# EasyEDA Pro project filter.eprj

# Schematic Schematic-LowPass
Board Name: Filter-LowPass; Create Date: 2025-11-16; Page Name: LowPass; Project Name: filter; Schematic Name: Schematic-LowPass; Update Date: 2025-11-16; Company: EasyEDA.com; Page Size: A4; Version: V1.0
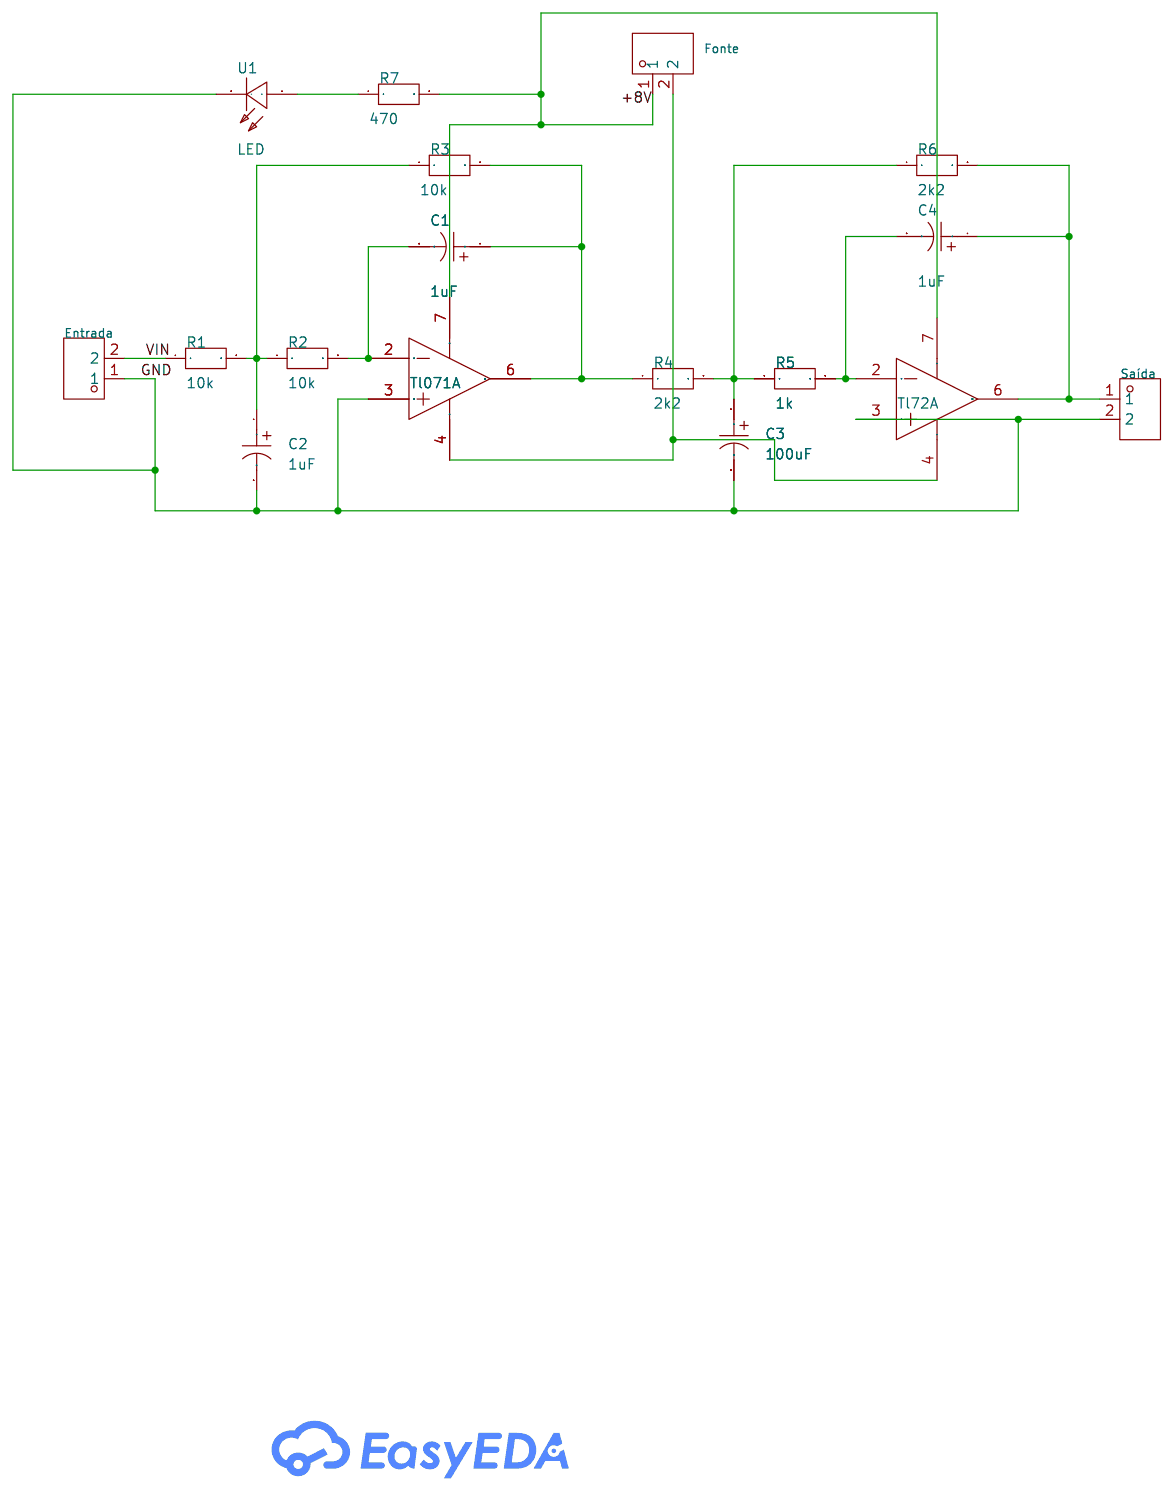
[diagram p0: schematic sheet]

## Parts
C1  1uF  [CAP-TH_BD5.0-P2.00-D0.5-FD-1]
C2  1uF  [CAP-TH_BD5.0-P2.00-D0.5-FD-1]
C3  100uF  [CAP-TH_BD5.0-P2.00-D0.5-FD-1]
C4  1uF  [CAP-TH_BD5.0-P2.00-D0.5-FD-1]
Entrada  KF128L-5.08-2P  [CONN-TH_P5.08_KF128L-5.08-2P]
Fonte  KF128L-5.08-2P  [CONN-TH_P5.08_KF128L-5.08-2P]
R1  10k  [RES-TH_BD2.3-L6.5-P10.50-D0.5]
R2  10k  [RES-TH_BD2.3-L6.5-P10.50-D0.5]
R3  10k  [RES-TH_BD2.3-L6.5-P10.50-D0.5]
R4  2k2  [RES-TH_BD2.3-L6.5-P10.50-D0.5]
R5  1k  [RES-TH_BD2.3-L6.5-P10.50-D0.5]
R6  2k2  [RES-TH_BD2.3-L6.5-P10.50-D0.5]
R7  470  [RES-TH_BD2.3-L6.5-P10.50-D0.5]
Saída  KF128L-5.08-2P  [CONN-TH_P5.08_KF128L-5.08-2P]
Tl071  CA3140N-TD  [DIP-8_L9.3-W6.4-P2.54-LS7.6-BL-1]  (section 1)
Tl72  CA3140N-TD  [DIP-8_L9.3-W6.4-P2.54-LS7.6-BL-1]  (section 1)
U1  LED  [LED-TH_BD4.0-P2.54-FD_RED]

## Library data of the parts
C1-C4 = 50V1uF CD110: LCSC Part Name: 1uF ±20% 50V; Supplier Part: C2960204; Manufacturer: HRK(鸿瑞凯电子); Supplier Footprint: 插件,D5xL11mm; JLCPCB Part Class: Extended Part; Datasheet: https://item.szlcsc.com/datasheet/50V1uF%2520CD110/3346916.html; Supplier: LCSC; Tolerance: ±20%; Voltage Rating: 50V; Pin Spacing: 2mm; Diameter: 5mm; Height - Seated (Max): 11mm; Operating Temperature: -40℃~+105℃
Entrada Fonte Saída = KF128L-5.08-2P: Structure:1x2P Pitch:5.08mm Color:Green Mounting Style:Straight Current Rating (Max):24A Voltage Rating (Max):250V Number of Pins:2P Number of Rows:1 Wire Gauge - AWG:12~22 Wire Gauge - AWG:12~22 Wire Gauge - mm2:2.5 Wire Gauge - mm2:2.5 Number of PINs Pe; LCSC Part Name: 5.08mm 1x2P 排数:1 每排P数:2 直插; Supplier Part: C474940; Manufacturer: KEFA(科发); Supplier Footprint: 插件,P=5.08mm; JLCPCB Part Class: Extended Part; Datasheet: https://atta.szlcsc.com/upload/public/pdf/source/20230317/B060EDB51EF5BF4A4FF6377D02780B11.pdf; Supplier: LCSC; Structure: 1x2P; Pitch: 5.08mm; Color: Green; Mounting Style: Straight; Current Rating (Max): 24A; Voltage Rating (Max): 250V; Number of Pins: 2P; Number of Rows: 1; Wire Gauge - AWG: 12~22; Wire Gauge - mm2: 2.5; Number of PINs Per Row: 2; Operating Temperature Range: -40℃~+105℃
R1-R7 = MF1/4W-1KΩ±1%T52: Type:Metal Film Resistors Resistance: Tolerance:±1% Tolerance:±1% Power(Watts):250mW Temperature Coefficient:±200ppm/℃ Temperature Coefficient:±200ppm/℃; LCSC Part Name: 金属膜电阻 1kΩ ±1% 250mW; Supplier Part: C713997; Manufacturer: 华星机电; Supplier Footprint: 插件,D2.3xL6.5mm; JLCPCB Part Class: Extended Part; Datasheet: https://atta.szlcsc.com/upload/public/pdf/source/20200731/C713882_AE8EB1102749D7E4FB4FB13DC898C429.pdf; Supplier: LCSC; Type: Metal Film Resistors; Tolerance: ±1%; Power(Watts): 250mW; Temperature Coefficient: ±200ppm/℃
Tl071 Tl72 = CA3140N-TD: Supplier Part: C52741396; Manufacturer: TDSEMIC(拓电半导体); Supplier Footprint: DIP-8; JLCPCB Part Class: Extended Part; Datasheet: https://item.szlcsc.com/datasheet/CA3140N-TD/55630013.html; Supplier: LCSC
U1 = LED: Supplier Part: C9900015665; Supplier Footprint: SIP-2P; JLCPCB Part Class: Extended Part; Supplier: LCSC

## Nets
+8V: Fonte.1 R7.2 Tl071.7(V+) Tl72.7(V+)
GND: C2.2 C3.2 Entrada.1 Saída.2 Tl071.3(IN+) Tl72.3(IN+) U1.2(-)
VIN: Entrada.2 R1.1
$1N827: C2.1 R1.2 R2.1 R3.1
$1N888: C1.1 R3.2 R4.1 Tl071.6(OUT)
$1N1062: C3.1 R4.2 R5.1 R6.1
$1N1233: C4.2 R5.2 Tl72.2(IN-)
$1N1279: C4.1 R6.2 Saída.1 Tl72.6(OUT)
$1N1381: Fonte.2 Tl071.4(V-) Tl72.4(V-)
$1N1539: R7.1 U1.1(+)
$1N2048: C1.2 R2.2 Tl071.2(IN-)

# Board LowPass
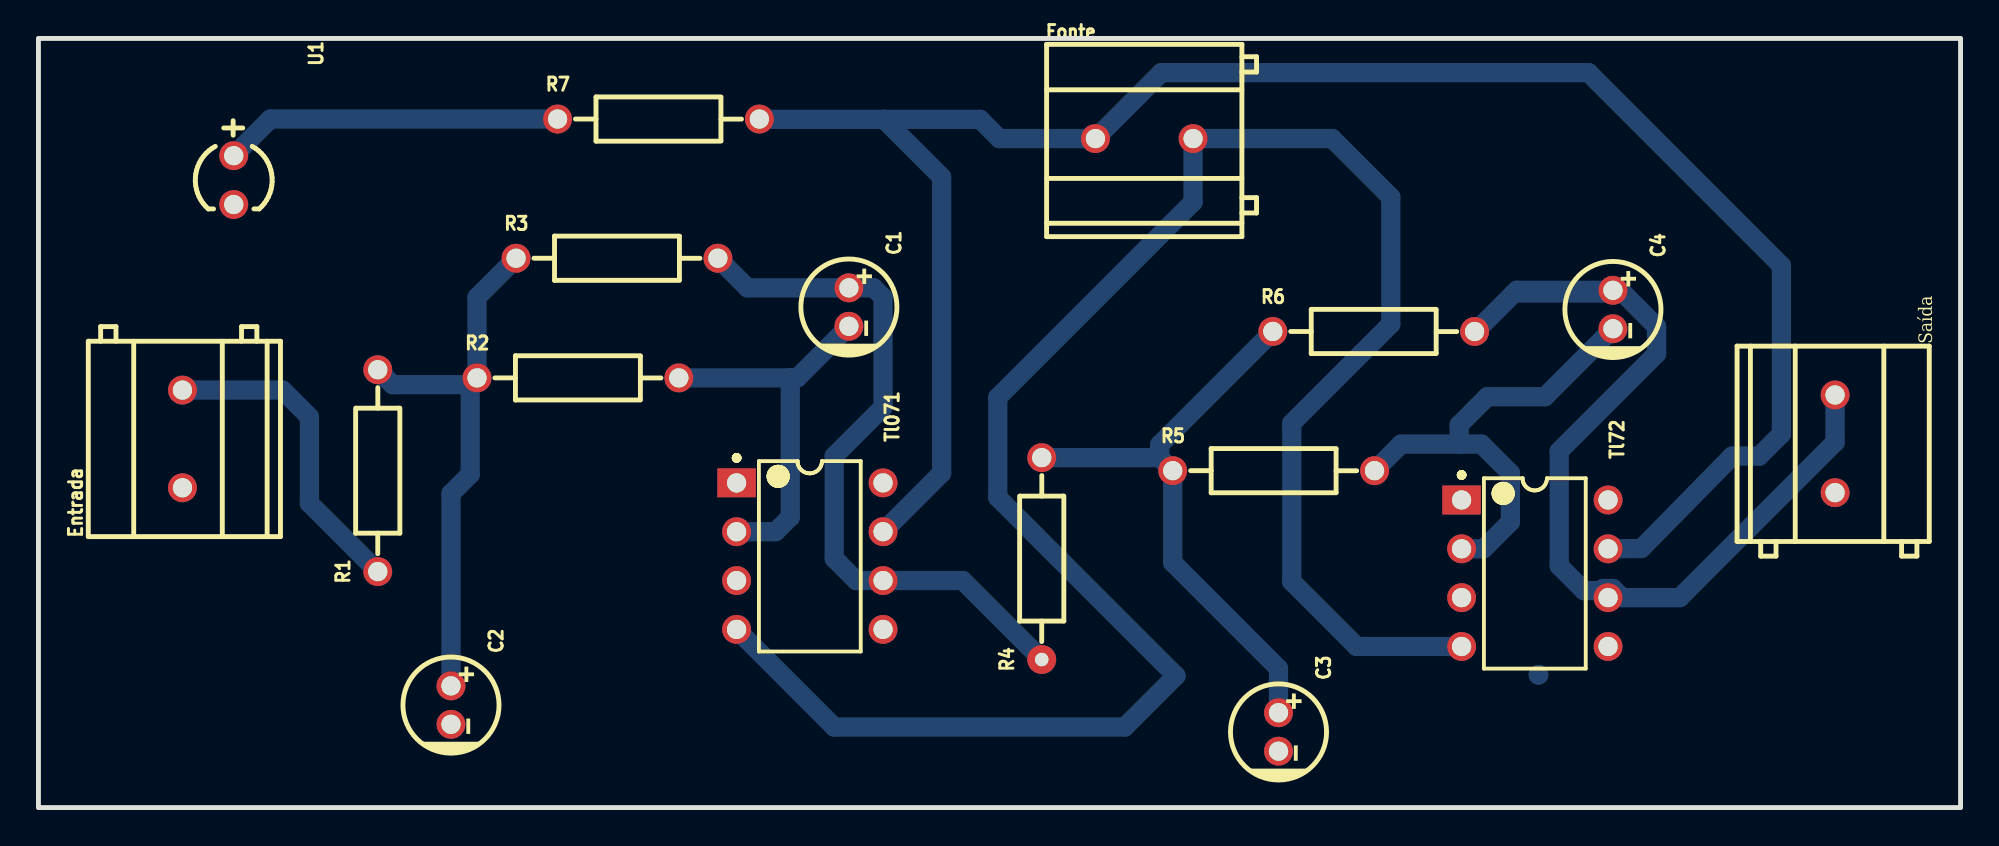
[diagram p1: board, top side]
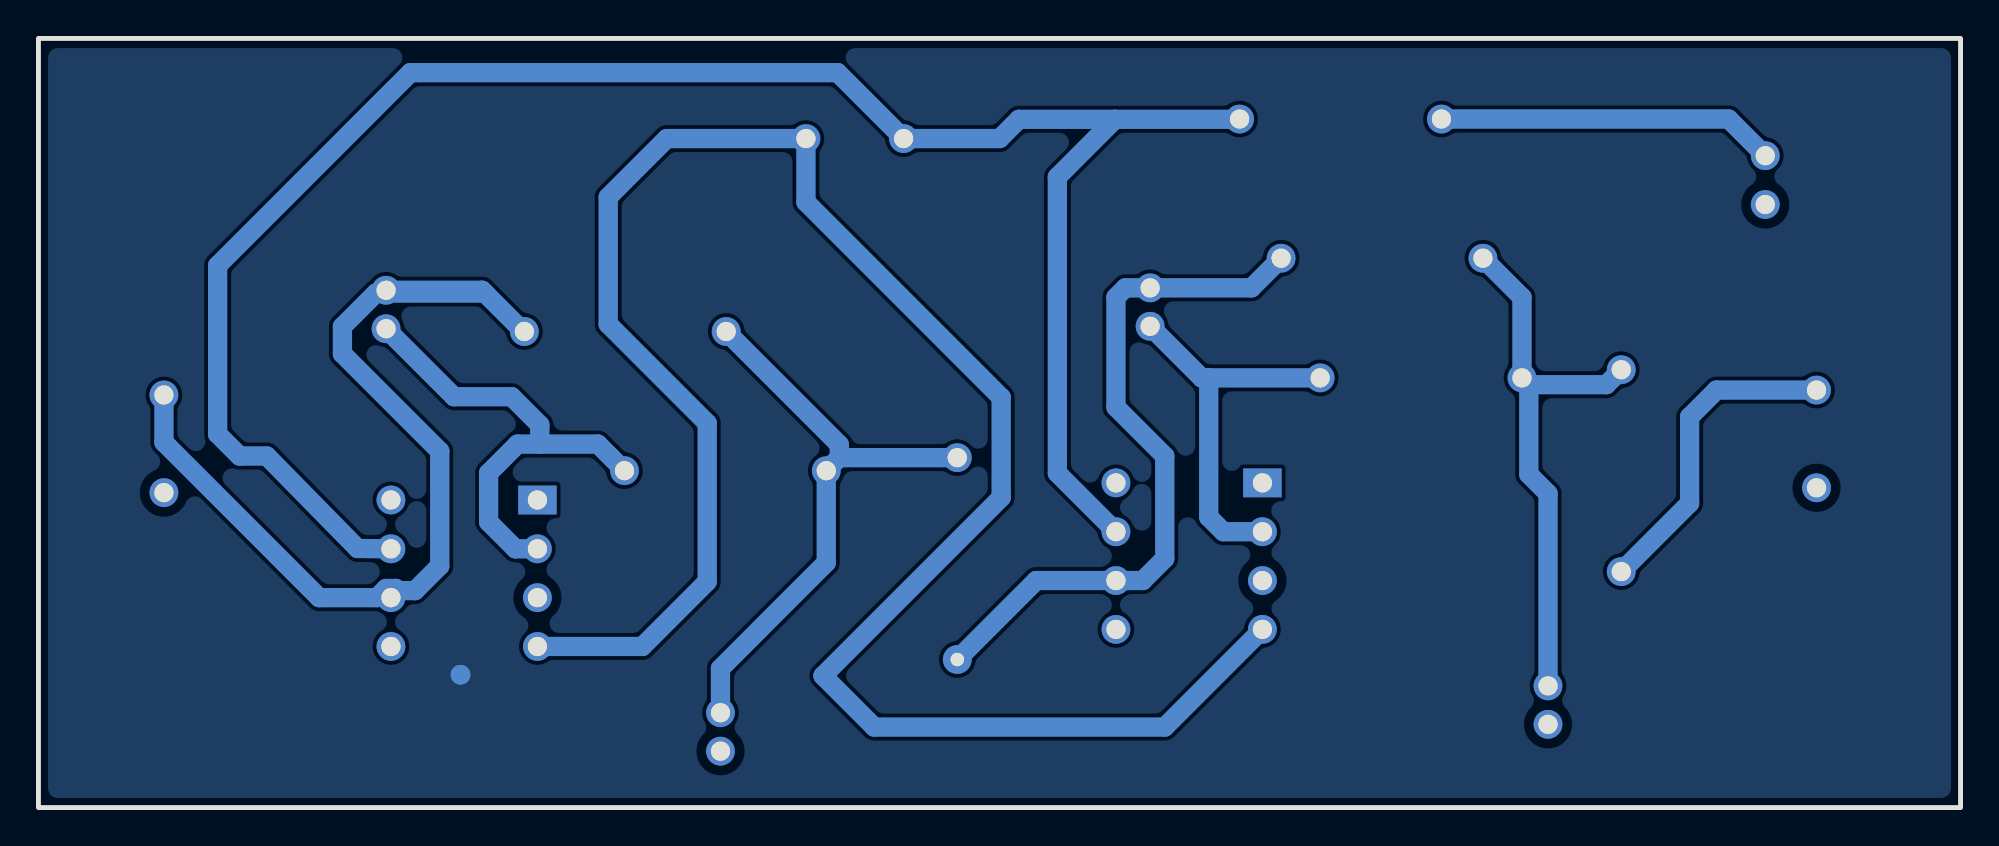
[diagram p2: board, bottom side, seen from below]

Outline 100 x 40 mm; copper layers: Top Layer, Bottom Layer. Coordinates in mm from the lower left corner of the outline.
Outline path: rectangle 0,40 100,0
Stack: Top Layer 0.035mm / Dielectric1 1.51mm FR4 er 4.5 / Bottom Layer 0.035mm

## Design rules (mm)
template: Custom Config
spacing copperThickness1oz (default): track to track 0.102, other pairs 0.152 to 0.3
spacing copperThickness2oz: track to track 0.203, other pairs 0.152 to 0.3
track width copperThickness1oz (default): min 1, default 1, max 1
track width copperThickness2oz: min 0.203, default 0.254, max 2.54
differential pair differentialPair (default): width min 0.127, default 0.254, max 2.54; gap min 0.152, default 0.152
via viaSize (default): diameter min 0.5, default 0.61, max 10; hole min 0.3, default 0.305, max 6.3
pour e13 uses copperRegion

## Placement (name value [footprint] x y rotation side)
C1  1uF  [CAP-TH_BD5.0-P2.00-D0.5-FD-1]  42.16 26.03 270 top
C2  1uF  [CAP-TH_BD5.0-P2.00-D0.5-FD-1]  21.46 5.33 270 top
C3  100uF  [CAP-TH_BD5.0-P2.00-D0.5-FD-1]  64.52 3.93 270 top
C4  1uF  [CAP-TH_BD5.0-P2.00-D0.5-FD-1]  81.92 25.9 270 top
Entrada  KF128L-5.08-2P  [CONN-TH_P5.08_KF128L-5.08-2P]  7.49 19.17 90 top
Fonte  KF128L-5.08-2P  [CONN-TH_P5.08_KF128L-5.08-2P]  57.53 34.79 0 top
R1  10k  [RES-TH_BD2.3-L6.5-P10.50-D0.5]  17.65 17.52 90 top
R2  10k  [RES-TH_BD2.3-L6.5-P10.50-D0.5]  28.07 22.35 0 top
R3  10k  [RES-TH_BD2.3-L6.5-P10.50-D0.5]  30.1 28.57 0 top
R4  2k2  [RES-TH_BD2.3-L6.5-P10.50-D0.5#2]  52.2 12.95 90 top
R5  1k  [RES-TH_BD2.3-L6.5-P10.50-D0.5]  64.26 17.52 0 top
R6  2k2  [RES-TH_BD2.3-L6.5-P10.50-D0.5]  69.47 24.76 0 top
R7  470  [RES-TH_BD2.3-L6.5-P10.50-D0.5]  32.26 35.81 0 top
Saída  KF128L-5.08-2P  [CONN-TH_P5.08_KF128L-5.08-2P]  93.47 18.92 270 top
Tl071  CA3140N-TD  [DIP-8_L9.3-W6.4-P2.54-LS7.6-BL-1]  40.13 13.08 270 top
Tl72  CA3140N-TD  [DIP-8_L9.3-W6.4-P2.54-LS7.6-BL-1]  77.85 12.19 270 top
U1  LED  [LED-TH_BD4.0-P2.54-FD_RED]  10.16 32.63 270 top

## Footprints (pads in the part's own frame, mm; a bottom-side part is the same pattern mirrored in y, then rotated)
CAP-TH_BD5.0-P2.00-D0.5-FD-1
  round 1.5 hole 1x0.5: 1(-1,0) 2(1,0)
CONN-TH_P5.08_KF128L-5.08-2P
  round 1.5 hole 1x0.5: 1(-2.54,0) 2(2.54,0)
DIP-8_L9.3-W6.4-P2.54-LS7.6-BL-1
  rect 1.5x2 hole 1x0.5: 1(-3.81,-3.81)
  round 1.5 hole 0.5x1: 2(-1.27,-3.81) 3(1.27,-3.81) 4(3.81,-3.81) 5(3.81,3.81) 6(1.27,3.81) 7(-1.27,3.81) 8(-3.81,3.81)
LED-TH_BD4.0-P2.54-FD_RED
  round 1.5 hole 1x0.5: 1(-1.27,0)
  round 1.5 hole 0.5x1: 2(1.27,0)
RES-TH_BD2.3-L6.5-P10.50-D0.5
  round 1.5 hole 1x0.5: 1(-5.25,0) 2(5.25,0)
RES-TH_BD2.3-L6.5-P10.50-D0.5#2
  round 1.5 hole 0.7: 1(-5.25,0)
  round 1.5 hole 1x0.5: 2(5.25,0)

## Nets
As in the schematic.

Pads without a net: Tl071 1 5 8; Tl72 1 5 8

## Routing (per net, layer and track width the routed paths; a pad name or vN(x,y) marks a point on that pad's centre or on a via; arc(x,y) is an arc through that point)
+8V: length 103.4
  Bottom Layer w1: R7.2 37.52,35.79 43.99,35.79 ; Tl72.7 83.4,13.47 88.12,18.28 89.53,18.28 90.68,19.43 90.68,28.19 80.64,38.22 58.42,38.22 Fonte.1 49.99,34.79 48.99,35.79 43.99,35.79 ; 43.99,35.79 46.99,32.79 46.99,17.39 Tl071.7
GND: length 0.1
  Bottom Layer w1: 78.03,6.91 78.04,6.9 78.05,6.91 78.04,6.92 78.03,6.91
VIN: length 16.7
  Bottom Layer w1: R1.1 14.1,15.83 14.1,20.31 12.7,21.71 Entrada.2
$1N827: length 28.8
  Bottom Layer w1: R1.2 18.43,21.99 22.46,21.99 ; 22.46,21.99 R2.1 22.82,26.54 R3.1 ; 22.46,21.99 22.46,17.33 21.46,16.33 C2.1
$1N888: length 37
  Bottom Layer w1: R3.2 36.89,27.03 C1.1 43.45,27.03 43.94,26.54 43.94,20.82 41.4,18.28 41.4,12.95 42.55,11.81 Tl071.6 48.09,11.81 R4.1
$1N1062: length 31
  Bottom Layer w1: 58.33,18.2 R4.2 ; 58.33,18.2 R5.1 59.01,12.74 64.52,7.23 C3.1 ; 58.33,18.2 58.33,18.87 R6.1
$1N1233: length 25
  Bottom Layer w1: 73.92,18.9 73.92,19.9 75.38,21.37 78.38,21.37 C4.2 ; 73.92,18.9 75.07,18.9 76.58,17.39 76.58,14.85 75.18,13.46 Tl72.2 ; 73.92,18.9 70.89,18.9 R5.2
$1N1279: length 52.2
  Bottom Layer w1: R6.2 74.77,24.76 76.77,26.76 ; 81.3,11.28 80.41,11.28 79.12,12.57 79.12,18.54 84.18,23.6 84.18,25.01 82.44,26.76 76.77,26.76 ; 81.3,11.28 81.41,11.39 81.92,11.39 82.39,10.92 85.39,10.92 93.47,19 93.47,21.46 ; 81.3,11.28 Tl72.6 ; 76.77,26.76 76.92,26.9 C4.1
$1N1381: length 106
  Bottom Layer w1: Tl72.4 68.58,8.38 65.21,11.75 65.21,19.99 70.36,25.14 70.36,31.74 67.31,34.79 Fonte.2 60.07,31.49 49.91,21.33 49.91,16.12 59.18,6.85 56.52,4.19 41.4,4.19 Tl071.4
$1N1539: length 17.6
  Bottom Layer w1: 10.16,33.9 12.07,35.81 R7.1
$1N2048: length 20.3
  Bottom Layer w1: 39.12,22.35 39.12,15.11 38.35,14.35 Tl071.2 ; 39.12,22.35 39.48,22.35 C1.2 ; 39.12,22.35 R2.2

## Copper pours and planes (outline as drawn; the poured copper is in the pictures)
GND on Bottom Layer: 0,39.64 100,39.64 100,-0.13 0,-0.13
